# Altium project 练一练3.PrjPcb
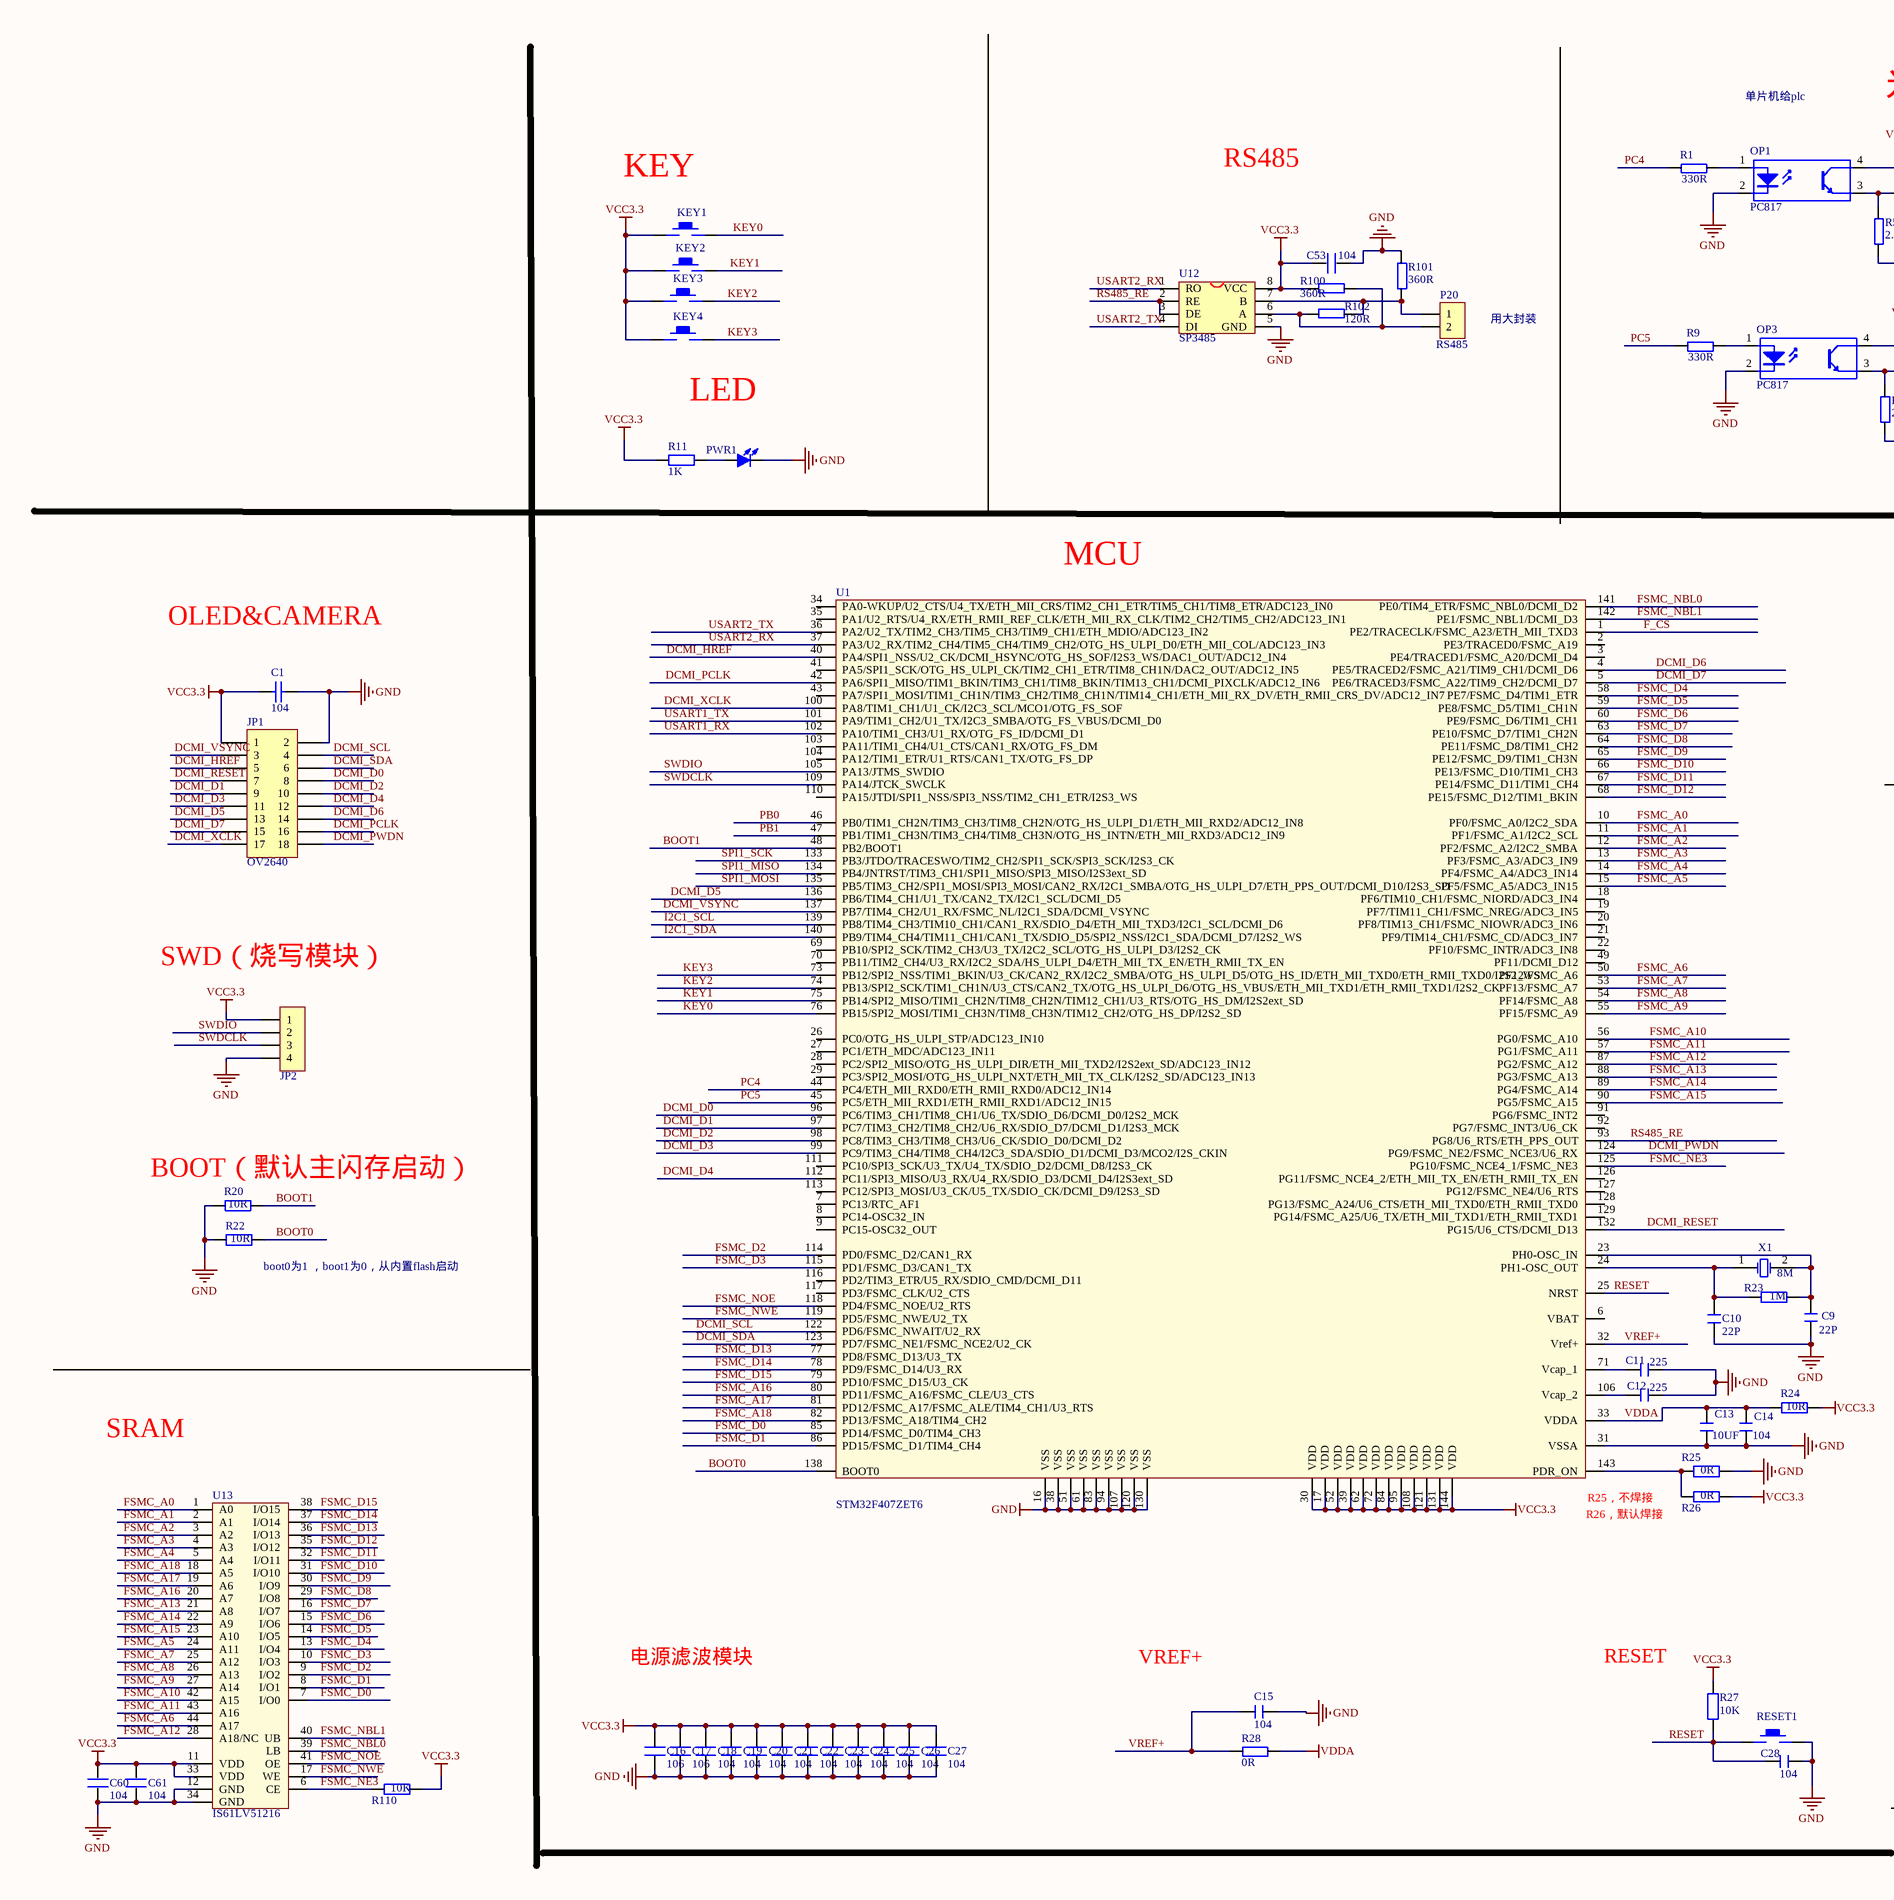
[diagram p0: 练一练3.SchDoc, left]
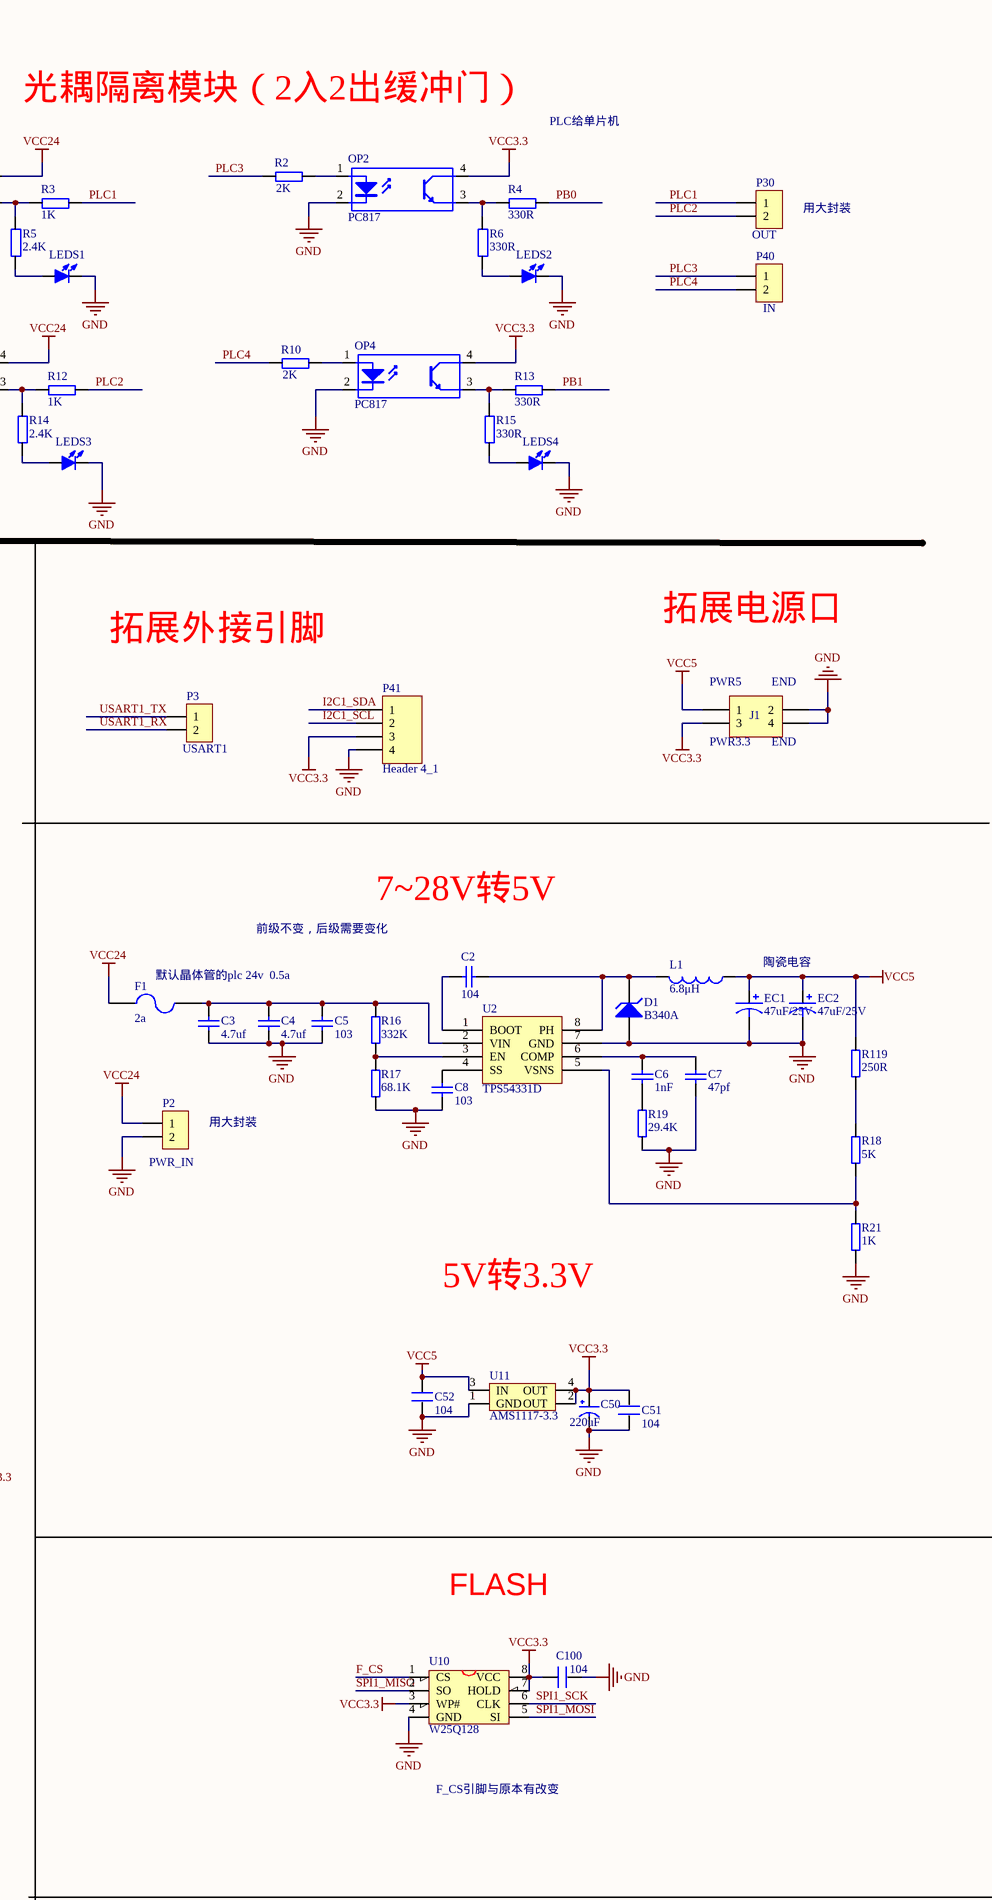
[diagram p1: 练一练3.SchDoc, right]
1 sheet, 101 parts. Net scope: global (net labels, ports and power ports of the same name join across sheets).
Board file: 练一练3.PcbDoc

## Sheet 练一练3.SchDoc
size A2

### Parts
C1  104  [C0805 - duplicate]
C2  104  [C0805 - duplicate]
C3  4.7uf  [C0805 - duplicate]
C4  4.7uf  [C0805 - duplicate]
C5  103  [C0805 - duplicate]
C6  1nF  [C0805 - duplicate]
C7  47pf  [C0805 - duplicate]
C8  103  [C0805 - duplicate]
C9  22P  [C 0805]
C10  22P  [C 0805]
C11  225  [C 0805]
C12  225  [C 0805]
C13  10UF  [C 0805]
C14  104  [C 0805]
C15  104  [C 0805]
C16  106  [C 0805]
C17  106  [C 0805]
C18  104  [C 0805]
C19  104  [C 0805]
C20  104  [C 0805]
C21  104  [C 0805]
C22  104  [C 0805]
C23  104  [C 0805]
C24  104  [C 0805]
C25  104  [C 0805]
C26  104  [C 0805]
C27  104  [C 0805]
C28  104  [C 0805]
C50  220uF  [Cap_8_12]
C51  104  [C0805 - duplicate]
C52  104  [C0805 - duplicate]
C53  104  [C0805 - duplicate]
C60  104  [C 0805]
C61  104  [C 0805]
C100  104  [C0805 - duplicate]
D1  B340A  [DO-214AC]
EC1  47uF/25V  [CAP_6.3*5MM]
EC2  47uF/25V  [CAP_6.3*5MM]
F1  2a  [fuse_big]
J1  PWR3.3       END  [HDR2X2]
JP1  OV2640  [HDR2X9]
JP2  SWD  [HDR1X4]  (value not drawn)
KEY1  KEY_M  [KEY_4Pin]  (value not drawn)
KEY2  KEY_M  [KEY_4Pin]  (value not drawn)
KEY3  KEY_M  [KEY_4Pin]  (value not drawn)
KEY4  KEY_M  [KEY_4Pin]  (value not drawn)
L1  6.8μH  [Hunter]
LEDS1  (no value)  [LED_dp]
LEDS2  (no value)  [LED_dp]
LEDS3  (no value)  [LED_dp]
LEDS4  (no value)  [LED_dp]
OP1  PC817  [SMD-4]
OP2  PC817  [SMD-4]
OP3  PC817  [SMD-4]
OP4  PC817  [SMD-4]
P2  PWR_IN  [HEAD2L-0.8]
P3  USART1  [HDR1X2]
P20  RS485  [HEAD2L-0.8]
P30  OUT  [HEAD2L-0.8]
P40  IN  [HEAD2L-0.8]
P41  Header 4_1  [HDR1X4]
PWR1  (no value)  [LED_dp]
R1  330R  [R0805]
R2  2K  [R0805]
R3  1K  [R0805]
R4  330R  [R0805]
R5  2.4K  [R0805]
R6  330R  [R0805]
R9  330R  [R0805]
R10  2K  [R0805]
R11  1K  [r0805 - duplicate]
R12  1K  [R0805]
R13  330R  [R0805]
R14  2.4K  [R0805]
R15  330R  [R0805]
R16  332K  [R0805]
R17  68.1K  [R0805]
R18  5K  [R0805]
R19  29.4K  [R0805]
R20  10R  [R0805]
R21  1K  [R0805]
R22  10R  [r0805 - duplicate]
R23  1M  [R 0805]
R24  10R  [R0805]
R25  0R  [r0805 - duplicate]
R26  0R  [r0805 - duplicate]
R27  10K  [R0805]
R28  0R  [r0805 - duplicate]
R100  360R  [R0805]
R101  360R  [R0805]
R102  120R  [R0805]
R110  10K  [r0805 - duplicate]
R119  250R  [R0805]
RESET1  KEY_M  [KEY-SMD1]  (value not drawn)
U1  STM32F407ZET6  [LQFP144 20X20_M]
U2  TPS54331D  [SOIC-8]
U10  W25Q128  [SOIC-8]
U11  AMS1117-3.3  [AMS1117]
U12  SP3485  [SOP-8]
U13  IS61LV51216  [TSOP44_M]
X1  8M  [49/S_N]

### Nets
GND: C1.2 C3.2 C4.2 C5.2 C7.2 C8.2 C9.1 C10.1 C11.2 C12.2 C13.1 C14.1 C15.1 C16.1 C17.1 C18.1 C19.1 C20.1 C21.1 C22.1 C23.1 C24.1 C25.1 C26.1 C27.1 C28.1 C50.2(GND) C51.1 C52.1 C53.2 C60.1 C61.1 C100.2 D1.1(A) EC1.2 EC2.2 J1.2 J1.4 JP1.2 JP2.4 LEDS1.2(K) LEDS2.2(K) LEDS3.2(K) LEDS4.2(K) OP1.2(K) OP2.2(K) OP3.2(K) OP4.2(K) P2.2 P41.4 PWR1.2(K) R17.1 R19.2 R20.1 R21.1 R22.1 R25.2 R101.2 RESET1.2 U1.16(VSS) U1.31(VSSA) U1.38(VSS) U1.51(VSS) U1.61(VSS) U1.83(VSS) U1.94(VSS) U1.107(VSS) U1.120(VSS) U1.130(VSS) U2.7(GND) U10.4(GND) U11.1(GND) U12.5(GND) U13.12(GND) U13.34(GND)
VCC3.3: C1.1 C16.2 C17.2 C18.2 C19.2 C20.2 C21.2 C22.2 C23.2 C24.2 C25.2 C26.2 C27.2 C50.1(VCC) C51.2 C53.1 C60.2 C61.2 C100.1 J1.3 JP1.1 JP2.1 KEY1.1 KEY2.1 KEY3.1 KEY4.1 OP2.4(C) OP4.4(C) P41.3 R11.1 R24.2 R26.2 R27.2 R100.2 R110.2 U1.17(VDD) U1.30(VDD) U1.39(VDD) U1.52(VDD) U1.62(VDD) U1.72(VDD) U1.84(VDD) U1.95(VDD) U1.108(VDD) U1.121(VDD) U1.131(VDD) U1.144(VDD) U10.3(WP#) U10.7(HOLD) U10.8(VCC) U11.2(OUT) U11.4(OUT) U12.8(VCC) U13.11(VDD) U13.33(VDD)
VCC5: C52.2 EC1.1 EC2.1 J1.1 L1.1 R119.2 U11.3(IN)
VCC24: F1.1 OP1.4(C) OP3.4(C) P2.1
VDDA: C13.2 C14.2 R24.1 R28.2 U1.33(VDDA)
BOOT0: R22.2 U1.138(BOOT0)
BOOT1: R20.2 U1.48(PB2/BOOT1)
DCMI_D0: JP1.8 U1.96(PC6/TIM3_CH1/TIM8_CH1/U6_TX/SDIO_D6/DCMI_D0/I2S2_MCK)
DCMI_D1: JP1.9 U1.97(PC7/TIM3_CH2/TIM8_CH2/U6_RX/SDIO_D7/DCMI_D1/I2S3_MCK)
DCMI_D2: JP1.10 U1.98(PC8/TIM3_CH3/TIM8_CH3/U6_CK/SDIO_D0/DCMI_D2)
DCMI_D3: JP1.11 U1.99(PC9/TIM3_CH4/TIM8_CH4/I2C3_SDA/SDIO_D1/DCMI_D3/MCO2/I2S_CKIN)
DCMI_D4: JP1.12 U1.112(PC11/SPI3_MISO/U3_RX/U4_RX/SDIO_D3/DCMI_D4/I2S3ext_SD)
DCMI_D5: JP1.13 U1.136(PB6/TIM4_CH1/U1_TX/CAN2_TX/I2C1_SCL/DCMI_D5)
DCMI_D6: JP1.14 U1.4(PE5/TRACED2/FSMC_A21/TIM9_CH1/DCMI_D6)
DCMI_D7: JP1.15 U1.5(PE6/TRACED3/FSMC_A22/TIM9_CH2/DCMI_D7)
DCMI_HREF: JP1.5 U1.40(PA4/SPI1_NSS/U2_CK/DCMI_HSYNC/OTG_HS_SOF/I2S3_WS/DAC1_OUT/ADC12_IN4)
DCMI_PCLK: JP1.16 U1.42(PA6/SPI1_MISO/TIM1_BKIN/TIM3_CH1/TIM8_BKIN/TIM13_CH1/DCMI_PIXCLK/ADC12_IN6)
DCMI_PWDN: JP1.18 U1.124(PG9/FSMC_NE2/FSMC_NCE3/U6_RX)
DCMI_RESET: JP1.7 U1.132(PG15/U6_CTS/DCMI_D13)
DCMI_SCL: JP1.4 U1.122(PD6/FSMC_NWAIT/U2_RX)
DCMI_SDA: JP1.6 U1.123(PD7/FSMC_NE1/FSMC_NCE2/U2_CK)
DCMI_VSYNC: JP1.3 U1.137(PB7/TIM4_CH2/U1_RX/FSMC_NL/I2C1_SDA/DCMI_VSYNC)
DCMI_XCLK: JP1.17 U1.100(PA8/TIM1_CH1/U1_CK/I2C3_SCL/MCO1/OTG_FS_SOF)
F_CS: U1.1(PE2/TRACECLK/FSMC_A23/ETH_MII_TXD3) U10.1(CS)
FSMC_A0: U1.10(PF0/FSMC_A0/I2C2_SDA) U13.1(A0)
FSMC_A1: U1.11(PF1/FSMC_A1/I2C2_SCL) U13.2(A1)
FSMC_A2: U1.12(PF2/FSMC_A2/I2C2_SMBA) U13.3(A2)
FSMC_A3: U1.13(PF3/FSMC_A3/ADC3_IN9) U13.4(A3)
FSMC_A4: U1.14(PF4/FSMC_A4/ADC3_IN14) U13.5(A4)
FSMC_A5: U1.15(PF5/FSMC_A5/ADC3_IN15) U13.24(A11)
FSMC_A6: U1.50(PF12/FSMC_A6) U13.44(A17)
FSMC_A7: U1.53(PF13/FSMC_A7) U13.25(A12)
FSMC_A8: U1.54(PF14/FSMC_A8) U13.26(A13)
FSMC_A9: U1.55(PF15/FSMC_A9) U13.27(A14)
FSMC_A10: U1.56(PG0/FSMC_A10) U13.42(A15)
FSMC_A11: U1.57(PG1/FSMC_A11) U13.43(A16)
FSMC_A12: U1.87(PG2/FSMC_A12) U13.28(A18/NC)
FSMC_A13: U1.88(PG3/FSMC_A13) U13.21(A8)
FSMC_A14: U1.89(PG4/FSMC_A14) U13.22(A9)
FSMC_A15: U1.90(PG5/FSMC_A15) U13.23(A10)
FSMC_A16: U1.80(PD11/FSMC_A16/FSMC_CLE/U3_CTS) U13.20(A7)
FSMC_A17: U1.81(PD12/FSMC_A17/FSMC_ALE/TIM4_CH1/U3_RTS) U13.19(A6)
FSMC_A18: U1.82(PD13/FSMC_A18/TIM4_CH2) U13.18(A5)
FSMC_D0: U1.85(PD14/FSMC_D0/TIM4_CH3) U13.7(I/O0)
FSMC_D1: U1.86(PD15/FSMC_D1/TIM4_CH4) U13.8(I/O1)
FSMC_D2: U1.114(PD0/FSMC_D2/CAN1_RX) U13.9(I/O2)
FSMC_D3: U1.115(PD1/FSMC_D3/CAN1_TX) U13.10(I/O3)
FSMC_D4: U1.58(PE7/FSMC_D4/TIM1_ETR) U13.13(I/O4)
FSMC_D5: U1.59(PE8/FSMC_D5/TIM1_CH1N) U13.14(I/O5)
FSMC_D6: U1.60(PE9/FSMC_D6/TIM1_CH1) U13.15(I/O6)
FSMC_D7: U1.63(PE10/FSMC_D7/TIM1_CH2N) U13.16(I/O7)
FSMC_D8: U1.64(PE11/FSMC_D8/TIM1_CH2) U13.29(I/O8)
FSMC_D9: U1.65(PE12/FSMC_D9/TIM1_CH3N) U13.30(I/O9)
FSMC_D10: U1.66(PE13/FSMC_D10/TIM1_CH3) U13.31(I/O10)
FSMC_D11: U1.67(PE14/FSMC_D11/TIM1_CH4) U13.32(I/O11)
FSMC_D12: U1.68(PE15/FSMC_D12/TIM1_BKIN) U13.35(I/O12)
FSMC_D13: U1.77(PD8/FSMC_D13/U3_TX) U13.36(I/O13)
FSMC_D14: U1.78(PD9/FSMC_D14/U3_RX) U13.37(I/O14)
FSMC_D15: U1.79(PD10/FSMC_D15/U3_CK) U13.38(I/O15)
FSMC_NBL0: U1.141(PE0/TIM4_ETR/FSMC_NBL0/DCMI_D2) U13.39(LB)
FSMC_NBL1: U1.142(PE1/FSMC_NBL1/DCMI_D3) U13.40(UB)
FSMC_NE3: R110.1 U1.125(PG10/FSMC_NCE4_1/FSMC_NE3) U13.6(CE)
FSMC_NOE: U1.118(PD4/FSMC_NOE/U2_RTS) U13.41(OE)
FSMC_NWE: U1.119(PD5/FSMC_NWE/U2_TX) U13.17(WE)
I2C1_SCL: P41.2 U1.139(PB8/TIM4_CH3/TIM10_CH1/CAN1_RX/SDIO_D4/ETH_MII_TXD3/I2C1_SCL/DCMI_D6)
I2C1_SDA: P41.1 U1.140(PB9/TIM4_CH4/TIM11_CH1/CAN1_TX/SDIO_D5/SPI2_NSS/I2C1_SDA/DCMI_D7/I2S2_WS)
KEY0: KEY1.2 U1.76(PB15/SPI2_MOSI/TIM1_CH3N/TIM8_CH3N/TIM12_CH2/OTG_HS_DP/I2S2_SD)
KEY1: KEY2.2 U1.75(PB14/SPI2_MISO/TIM1_CH2N/TIM8_CH2N/TIM12_CH1/U3_RTS/OTG_HS_DM/I2S2ext_SD)
KEY2: KEY3.2 U1.74(PB13/SPI2_SCK/TIM1_CH1N/U3_CTS/CAN2_TX/OTG_HS_ULPI_D6/OTG_HS_VBUS/ETH_MII_TXD1/ETH_RMII_TXD1/I2S2_CK)
KEY3: KEY4.2 U1.73(PB12/SPI2_NSS/TIM1_BKIN/U3_CK/CAN2_RX/I2C2_SMBA/OTG_HS_ULPI_D5/OTG_HS_ID/ETH_MII_TXD0/ETH_RMII_TXD0/I2S2_WS)
PB0: R4.2 U1.46(PB0/TIM1_CH2N/TIM3_CH3/TIM8_CH2N/OTG_HS_ULPI_D1/ETH_MII_RXD2/ADC12_IN8)
PB1: R13.2 U1.47(PB1/TIM1_CH3N/TIM3_CH4/TIM8_CH3N/OTG_HS_INTN/ETH_MII_RXD3/ADC12_IN9)
PC4: R1.1 U1.44(PC4/ETH_MII_RXD0/ETH_RMII_RXD0/ADC12_IN14)
PC5: R9.1 U1.45(PC5/ETH_MII_RXD1/ETH_RMII_RXD1/ADC12_IN15)
PLC1: P30.1 R3.2
PLC2: P30.2 R12.2
PLC3: P40.1 R2.1
PLC4: P40.2 R10.1
RESET: C28.2 R27.1 RESET1.1 U1.25(NRST)
RS485_RE: U1.93(PG8/U6_RTS/ETH_PPS_OUT) U12.2(RE) U12.3(DE)
SPI1_MISO: U1.134(PB4/JNTRST/TIM3_CH1/SPI1_MISO/SPI3_MISO/I2S3ext_SD) U10.2(SO)
SPI1_MOSI: U1.135(PB5/TIM3_CH2/SPI1_MOSI/SPI3_MOSI/CAN2_RX/I2C1_SMBA/OTG_HS_ULPI_D7/ETH_PPS_OUT/DCMI_D10/I2S3_SD) U10.5(SI)
SPI1_SCK: U1.133(PB3/JTDO/TRACESWO/TIM2_CH2/SPI1_SCK/SPI3_SCK/I2S3_CK) U10.6(CLK)
SWDCLK: JP2.3 U1.109(PA14/JTCK_SWCLK)
SWDIO: JP2.2 U1.105(PA13/JTMS_SWDIO)
USART1_RX: P3.2 U1.102(PA10/TIM1_CH3/U1_RX/OTG_FS_ID/DCMI_D1)
USART1_TX: P3.1 U1.101(PA9/TIM1_CH2/U1_TX/I2C3_SMBA/OTG_FS_VBUS/DCMI_D0)
USART2_RX: U1.37(PA3/U2_RX/TIM2_CH4/TIM5_CH4/TIM9_CH2/OTG_HS_ULPI_D0/ETH_MII_COL/ADC123_IN3) U12.1(RO)
USART2_TX: U1.36(PA2/U2_TX/TIM2_CH3/TIM5_CH3/TIM9_CH1/ETH_MDIO/ADC123_IN2) U12.4(DI)
VREF+: C15.2 R28.1 U1.32(Vref+)
NetC2_1: C2.1 U2.1(BOOT)
NetC2_2: C2.2 D1.2(K) L1.2 U2.8(PH)
NetC3_1: C3.1 C4.1 C5.1 F1.2 R16.1 U2.2(VIN)
NetC6_1: C6.1 C7.1 U2.6(COMP)
NetC6_2: C6.2 R19.1
NetC8_1: C8.1 U2.4(SS)
NetC9_2: C9.2 R23.2 U1.23(PH0-OSC_IN) X1.2(OSC2)
NetC10_2: C10.2 R23.1 U1.24(PH1-OSC_OUT) X1.1(OSC1)
NetC11_1: C11.1 U1.71(Vcap_1)
NetC12_1: C12.1 U1.106(Vcap_2)
NetLEDS1_1: LEDS1.1(A) R5.1
NetLEDS2_1: LEDS2.1(A) R6.1
NetLEDS3_1: LEDS3.1(A) R14.1
NetLEDS4_1: LEDS4.1(A) R15.1
NetOP1_1: OP1.1(A) R1.2
NetOP1_3: OP1.3(E) R3.1 R5.2
NetOP2_1: OP2.1(A) R2.2
NetOP2_3: OP2.3(E) R4.1 R6.2
NetOP3_1: OP3.1(A) R9.2
NetOP3_3: OP3.3(E) R12.1 R14.2
NetOP4_1: OP4.1(A) R10.2
NetOP4_3: OP4.3(E) R13.1 R15.2
NetP20_1: P20.1 R101.1 R102.1 U12.7(B)
NetP20_2: P20.2 R100.1 R102.2 U12.6(A)
NetPWR1_1: PWR1.1(A) R11.2
NetR16_2: R16.2 R17.2 U2.3(EN)
NetR18_1: R18.1 R21.2 U2.5(VSNS)
NetR18_2: R18.2 R119.1
NetR25_1: R25.1 R26.1 U1.143(PDR_ON)

Not connected (* = marked no-connect by the designer): U1 2(PE3/TRACED0/FSMC_A19) 3(PE4/TRACED1/FSMC_A20/DCMI_D4) 6(VBAT) 7(PC13/RTC_AF1) 8(PC14-OSC32_IN) 9(PC15-OSC32_OUT) 18(PF6/TIM10_CH1/FSMC_NIORD/ADC3_IN4) 19(PF7/TIM11_CH1/FSMC_NREG/ADC3_IN5) 20(PF8/TIM13_CH1/FSMC_NIOWR/ADC3_IN6) 21(PF9/TIM14_CH1/FSMC_CD/ADC3_IN7) 22(PF10/FSMC_INTR/ADC3_IN8) 26(PC0/OTG_HS_ULPI_STP/ADC123_IN10) 27(PC1/ETH_MDC/ADC123_IN11) 28(PC2/SPI2_MISO/OTG_HS_ULPI_DIR/ETH_MII_TXD2/I2S2ext_SD/ADC123_IN12) 29(PC3/SPI2_MOSI/OTG_HS_ULPI_NXT/ETH_MII_TX_CLK/I2S2_SD/ADC123_IN13) 34(PA0-WKUP/U2_CTS/U4_TX/ETH_MII_CRS/TIM2_CH1_ETR/TIM5_CH1/TIM8_ETR/ADC123_IN0) 35(PA1/U2_RTS/U4_RX/ETH_RMII_REF_CLK/ETH_MII_RX_CLK/TIM2_CH2/TIM5_CH2/ADC123_IN1) 41(PA5/SPI1_SCK/OTG_HS_ULPI_CK/TIM2_CH1_ETR/TIM8_CH1N/DAC2_OUT/ADC12_IN5) 43(PA7/SPI1_MOSI/TIM1_CH1N/TIM3_CH2/TIM8_CH1N/TIM14_CH1/ETH_MII_RX_DV/ETH_RMII_CRS_DV/ADC12_IN7) 49(PF11/DCMI_D12) 69(PB10/SPI2_SCK/TIM2_CH3/U3_TX/I2C2_SCL/OTG_HS_ULPI_D3/I2S2_CK) 70(PB11/TIM2_CH4/U3_RX/I2C2_SDA/HS_ULPI_D4/ETH_MII_TX_EN/ETH_RMII_TX_EN) 91(PG6/FSMC_INT2) 92(PG7/FSMC_INT3/U6_CK) 103(PA11/TIM1_CH4/U1_CTS/CAN1_RX/OTG_FS_DM) 104(PA12/TIM1_ETR/U1_RTS/CAN1_TX/OTG_FS_DP) 110(PA15/JTDI/SPI1_NSS/SPI3_NSS/TIM2_CH1_ETR/I2S3_WS) 111(PC10/SPI3_SCK/U3_TX/U4_TX/SDIO_D2/DCMI_D8/I2S3_CK) 113(PC12/SPI3_MOSI/U3_CK/U5_TX/SDIO_CK/DCMI_D9/I2S3_SD) 116(PD2/TIM3_ETR/U5_RX/SDIO_CMD/DCMI_D11) 117(PD3/FSMC_CLK/U2_CTS) 126(PG11/FSMC_NCE4_2/ETH_MII_TX_EN/ETH_RMII_TX_EN) 127(PG12/FSMC_NE4/U6_RTS) 128(PG13/FSMC_A24/U6_CTS/ETH_MII_TXD0/ETH_RMII_TXD0) 129(PG14/FSMC_A25/U6_TX/ETH_MII_TXD1/ETH_RMII_TXD1)

### Notes on the sheet
- 单片机给plc
- 光耦隔离模块（2入2出缓冲门）
- PLC给单片机
- (near KEY1) KEY
- RS485
- (near P30) 用大封装
- 用大封装
- LED
- OLED&CAMERA
- (near U1) MCU
- 拓展外接引脚
- 拓展电源口
- (near J1) PWR5          END
- 7~28V转5V
- 默认晶体管的plc 24v  0.5a
- 前级不变，后级需要变化
- 陶瓷电容
- (near JP2) SWD（烧写模块）
- (near P2) 用大封装
- (near R20) BOOT（默认主闪存启动）
- 5V转3.3V
- (near R22) boot0为1 ，boot1为0，从内置flash启动
- SRAM
- (near U1) R26，默认焊接
- (near U1) R25，不焊接
- FLASH
- 电源滤波模块
- VREF+
- RESET
- F_CS引脚与原本有改变

### Library data of the parts
C1-C8 = Cap0: Default Capacitor; Published: 8-Jun-2000; LatestRevisionDate: 17-Jul-2002; LatestRevisionNote: Re-released for DXP Platform.; PackageReference: RAD-0.3; Publisher: Altium Limited
C9-C15 C28 = C: 无极性贴片电容; 版权归属: 源创客; 材质: X7R; BOM名称: 无极性贴片电容; 学习资源: www.ooocke.com
C16-C27 C51-C53 C60 C61 C100 = C
C50 = CAP
D1 = D Zener: 瞬态抑制二极管; Published: 8-Jun-2000; LatestRevisionDate: 17-Jul-2002; LatestRevisionNote: Re-released for DXP Platform.; PackageReference: DIODE-0.7; Publisher: Altium Limited; PackageDescription: Diode, Thru-Hole; 2 Leads; 0.7 in Pin Spacing
EC1 EC2 = Cap2: Polarized Capacitor (Axial); Published: 8-Jun-2000; LatestRevisionDate: 17-Jul-2002; LatestRevisionNote: Re-released for DXP Platform.; PackageReference: POLAR0.8; Publisher: Altium Limited; PackageDescription: Polarized Capacitor; 2 Leads
F1 = Fuse1: Fuse; Published: 8-Jun-2000; LatestRevisionDate: 17-Jul-2002; LatestRevisionNote: Re-released for DXP Platform.; PackageReference: PIN-W2/E2.8; Publisher: Altium Limited; PackageDescription: Thru-Hole; 2 Leads
J1 = Header 2X2: Header, 2-Pin, Dual row; LatestRevisionDate: 17-Jul-2002; LatestRevisionNote: Re-released for DXP Platform.; Publisher: Altium Limited
JP1 = Header 9X2: Header, 9-Pin, Dual row; LatestRevisionDate: 17-Jul-2002; LatestRevisionNote: Re-released for DXP Platform.; Publisher: Altium Limited
JP2 = Header 4: 4P接插件; 版权归属: 源创客; BOM名称: 4P接插件; 学习资源: www.ooocke.com
L1 = Inductor: Code_IEC: 1005; Published: 8-Jun-2000; LatestRevisionDate: 17-Jul-2002; LatestRevisionNote: Re-released for DXP Platform.; PackageReference: 0402-A; Publisher: Altium Limited; Code_JEITA: 0402
LEDS1-LEDS4 PWR1 = LED-SMD: 贴片LED; 版权归属: 源创客; BOM名称: 贴片LED; 学习资源: www.ooocke.com
OP1-OP4 = Optoisolator: 4-Pin Phototransistor Optocoupler; Published: 24-Mar-1999; LatestRevisionDate: 04-Mar-2005; LatestRevisionNote: Sch pins 3 & 4 Swapped.; DatasheetDocument: Nov-2003; PackageReference: DIP-4; Publisher: Altium Limited
P2 P3 P20 P30 P40 = Header 1x2
P41 = Header 4_1: Header, 4-Pin; LatestRevisionDate: 17-Jul-2002; LatestRevisionNote: Re-released for DXP Platform.; Publisher: Altium Limited
R1 R2 R9 R10 = R_1
R3-R6 R12-R15 = R_3
R11 R20 R22-R27 R110 = R: 贴片电阻; 版权归属: 源创客; BOM名称: 贴片电阻; 学习资源: www.ooocke.com
R16-R19 R21 R119 = Res0: default resistor
R28 R100-R102 = R
U2 = TPS54331DDAR
U10 = W25X16: W25X16;SST25VF016;MX25L1605
U11 = AMS1117
U12 = MAX3485
U13 = IS61LV51216: SRAM芯片
X1 = XTAL: Crystal Oscillator; Published: *; LatestRevisionDate: *; LatestRevisionNote: *; Publisher: *